# EAGLE design HPF_1_0 (EAGLE 8.3.2)
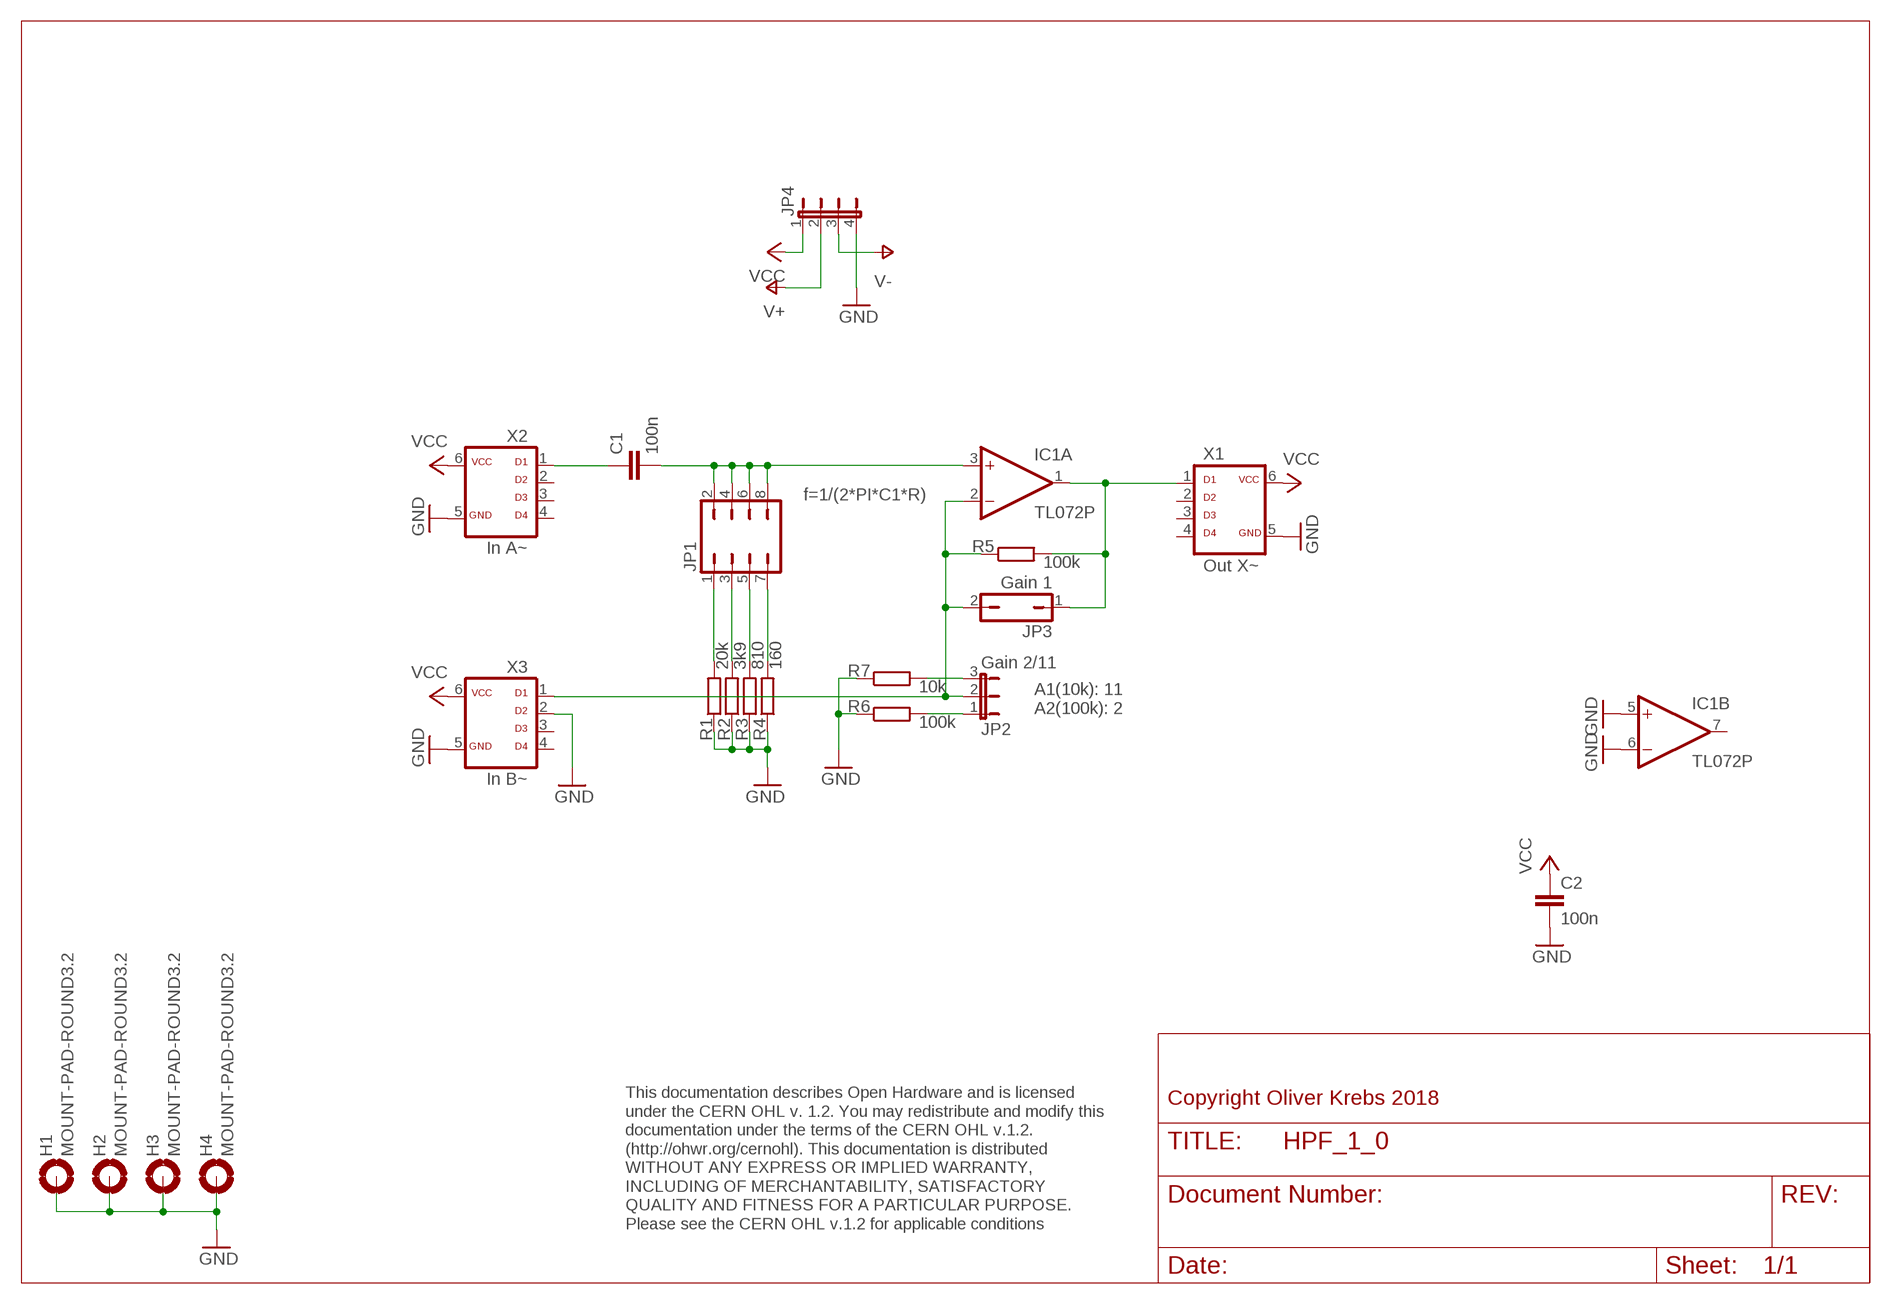
[diagram p0: schematic, sheet 1]

## Parts
C1  100n  C-EU050-025X075  [C050-025X075]
C2  100n  C-EU050-025X075  [C050-025X075]
H1  MOUNT-PAD-ROUND3.2  [3,2-PAD]
H2  MOUNT-PAD-ROUND3.2  [3,2-PAD]
H3  MOUNT-PAD-ROUND3.2  [3,2-PAD]
H4  MOUNT-PAD-ROUND3.2  [3,2-PAD]
IC1  TL072P  [DIL08]
JP1  JP4Q  [JP4Q]
JP2  Gain 2/11  JP2EJP2-U  [JP2-U]
JP3  Gain 1  JP1Q  [JP1]
JP4  JP4E  [JP4]
R1  20k  R-EU_0207/10  [0207/10]
R2  3k9  R-EU_0207/10  [0207/10]
R3  810  R-EU_0207/10  [0207/10]
R4  160  R-EU_0207/10  [0207/10]
R5  100k  R-EU_0207/10  [0207/10]
R6  100k  R-EU_0207/10  [0207/10]
R7  10k  R-EU_0207/10  [0207/10]
X1  Out X~  ML6D  [ML-6]
X2  In A~  ML6D  [ML-6]
X3  In B~  ML6D  [ML-6]

## Nets
GND: C2.2 H1.B3,2(MOUNT) H2.B3,2(MOUNT) H3.B3,2(MOUNT) H4.B3,2(MOUNT) IC1.5(B:+IN) IC1.6(B:-IN) JP4.4 R1.1 R2.1 R3.1 R4.1 R6.1 R7.1 X1.5 X2.5 X3.2 X3.5
N$1: JP1.1 R1.2
N$2: JP1.3 R2.2
N$3: JP1.5 R3.2
N$4: JP1.7 R4.2
N$5: IC1.2(A:-IN) JP2.2 JP3.2 R5.1 X3.1
N$6: C1.2 IC1.3(A:+IN) JP1.2 JP1.4 JP1.6 JP1.8
N$7: C1.1 X2.1
N$9: IC1.1(A:OUT) JP3.1 R5.2 X1.1
N$10: JP2.3 R7.2
N$11: JP2.1 R6.2
V+: JP4.2
V-: JP4.3
VCC: C2.1 JP4.1 X1.6 X2.6 X3.6
Unconnected: IC1.7(B:OUT) X1.2 X1.3 X1.4 X2.2 X2.3 X2.4 X3.3 X3.4

## Notes on the sheet
- f=1/(2*PI*C1*R)
- A1(10k): 11
  A2(100k): 2
- Copyright Oliver Krebs 2018
- This documentation describes Open Hardware and is licensed 
  under the CERN OHL v. 1.2. You may redistribute and modify this 
  documentation under the terms of the CERN OHL v.1.2. 
  (http://ohwr.org/cernohl). This documentation is distributed
  WITHOUT ANY EXPRESS OR IMPLIED WARRANTY, 
  INCLUDING OF MERCHANTABILITY, SATISFACTORY 
  QUALITY AND FITNESS FOR A PARTICULAR PURPOSE. 
  Please see the CERN OHL v.1.2 for applicable conditions

## Power pins joined to a net without a drawn wire
V+: IC1.8(P:V+)
V-: IC1.4(P:V-)

## Library data of the parts
C1 C2 = 01-my_rcl:C-EU: CAPACITOR, European symbol
H1-H4 = holes:MOUNT-PAD-ROUND: MOUNTING PAD, round
IC1 = 01-my-linear:TL072: OP AMP
JP1 = 01-my-jumper:JP4Q: JUMPER
JP2 = 01-my-jumper:JP2E: JUMPER
JP3 = 01-my-jumper:JP1Q: JUMPER
JP4 = 01-my-jumper:JP4E: JUMPER
R1-R7 = 01-my_rcl:R-EU_: RESISTOR, European symbol
X1-X3 = 01-my-con:ML6D

## Board
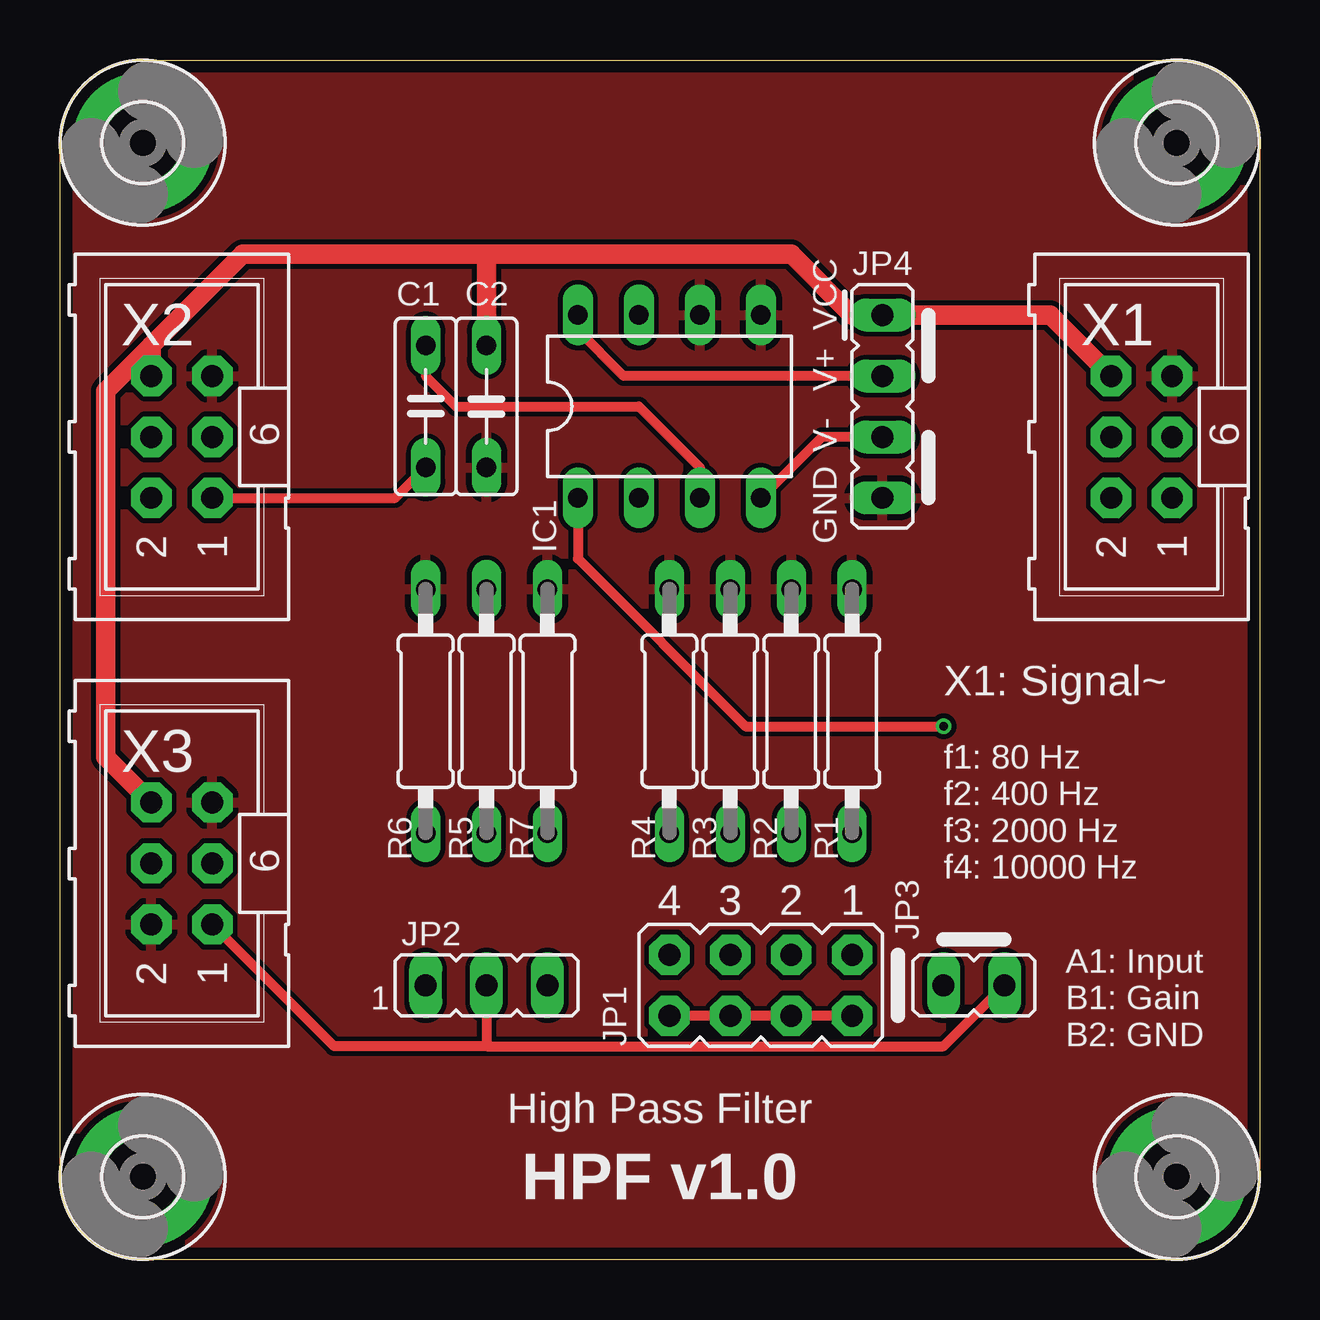
[diagram p1: board, top side]
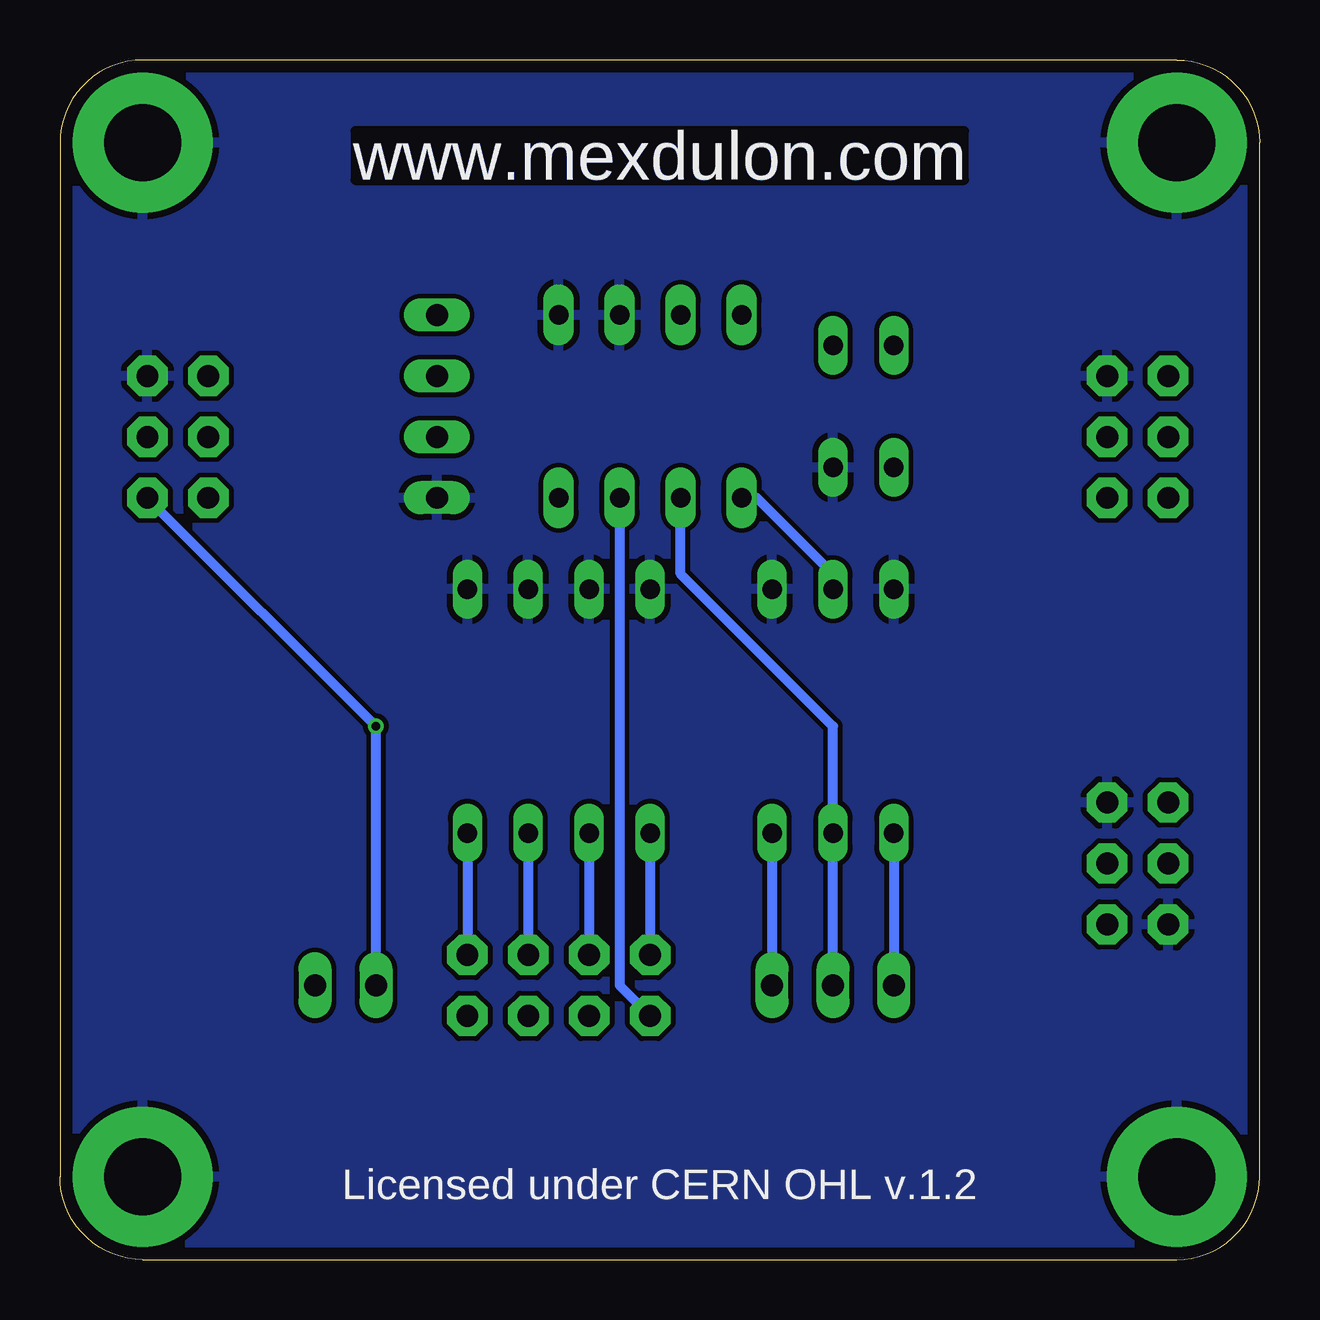
[diagram p2: board, bottom side, seen from below]

Size 50 x 50 mm. Coordinates in mm from the lower left corner, seen from the top.
Outline: 0,3.45 0,46.55 arc-90 3.45,50 46.55,50 arc-90 50,46.55 50,3.45 arc-90 46.55,0 3.45,0 arc-90 0,3.45
Copper layers (1*16): Top 0.035mm / dielectric 1.6mm / Bottom 0.035mm
Design rules "Elecrow_2-layer_PCB_eagle_rule_8mil": minimum track width 8mil, minimum drill 12mil, track to track 8mil, track to pad 8mil, pad to pad 8mil, via to via 8mil, smd to smd 0mil, copper to edge 20mil, drill to drill 10mil, minimum pad ring 6mil, minimum via ring 6mil, stop-mask expansion 0mil, vias tented up to drill 100mil, thermal gap 10mil

### Footprints (pad centres in the part's own frame; a part is rotated, then mirrored left to right if it is on the bottom)
C050-025X075 = drill 0.813 long: 1 -2.54,0; 2 2.54,0
3,2-PAD = drill 3.2 pad 5.842: B3,2 0,0
DIL08 = drill 0.813 pad 1.27 long: 1 -3.81,-3.81; 2 -1.27,-3.81; 3 1.27,-3.81; 4 3.81,-3.81; 5 3.81,3.81; 6 1.27,3.81; 7 -1.27,3.81; 8 -3.81,3.81
JP4Q = drill 0.914 pad 1.676 octagon: 1 -3.81,-1.27; 2 -3.81,1.27; 3 -1.27,-1.27; 4 -1.27,1.27; 5 1.27,-1.27; 6 1.27,1.27; 7 3.81,-1.27; 8 3.81,1.27
JP2-U = drill 0.914 long: 1 -2.54,0; 2 0,0; 3 2.54,0
JP1 = drill 0.914 long: 1 0,-1.27; 2 0,1.27
JP4 = drill 0.914 long: 1 -3.81,0; 2 -1.27,0; 3 1.27,0; 4 3.81,0
0207/10 = drill 0.813 long: 1 -5.08,0; 2 5.08,0
ML-6 = drill 0.914 pad 1.676 octagon: 1 -2.54,-1.27; 2 -2.54,1.27; 3 0,-1.27; 4 0,1.27; 5 2.54,-1.27; 6 2.54,1.27

### Placement (x,y rotation side)
C1  15.24,35.56 90 top
C2  17.78,35.56 270 top
H1  3.45,3.45 0 top
H2  3.45,46.55 0 top
H3  46.55,46.55 0 top
H4  46.55,3.45 0 top
IC1  25.4,35.56 0 top
JP1  29.21,11.43 180 top
JP2  17.78,11.43 0 top
JP3  38.1,11.43 270 top
JP4  34.29,35.56 270 top
R1  33.02,22.86 270 top
R2  30.48,22.86 270 top
R3  27.94,22.86 270 top
R4  25.4,22.86 270 top
R5  17.78,22.86 90 top
R6  15.24,22.86 270 top
R7  20.32,22.86 270 top
X1  45.09,34.29 90 top
X2  5.08,34.29 90 top
X3  5.08,16.51 90 top

### Tracks (layer width: path | path; a pad name or v marks a point on that pad's centre or on a via)
GND
  pour Bottom (isolate 0.203): 0,50.16 50.8,50.16 50.8,0 0,0
  pour Top (isolate 0.203): 0,50.16 50.8,50.16 50.8,0 0,0
N$1
  Bottom 0.406: R1.2 JP1.1
N$2
  Bottom 0.406: R2.2 JP1.3
N$3
  Bottom 0.406: R3.2 JP1.5
N$4
  Bottom 0.406: R4.2 JP1.7
N$5
  Top 0.406: 17.78,8.89 11.43,8.89 X3.1 | 17.78,8.89 36.83,8.89 JP3.2 | JP2.2 17.78,8.89
  Bottom 0.406: JP2.2 R5.1 17.78,22.23 24.13,28.57 IC1.2
N$6
  Top 0.406: C1.2 15.24,36.83 16.51,35.56 24.13,35.56 26.67,33.02 IC1.3 | JP1.2 JP1.4 JP1.6 JP1.8
  Bottom 0.406: IC1.3 26.67,11.43 JP1.8
N$7
  Top 0.406: X2.1 13.97,31.75 C1.1
N$9  (via drill 0.35)
  Top 0.406: IC1.1 21.59,29.21 28.57,22.23 v36.83,22.23
  Bottom 0.406: JP3.1 v36.83,22.23 X1.1 | R5.2 17.78,28.57 20.95,31.75 IC1.1
N$10
  Bottom 0.406: R7.2 JP2.3
N$11
  Bottom 0.406: R6.2 JP2.1
V+
  Top 0.406: JP4.2 23.5,36.83 21.59,38.73 IC1.8
V-
  Top 0.406: JP4.3 31.75,34.29 IC1.4
VCC
  Top 0.813: X1.6 41.27,39.37 JP4.1 33.02,39.37 30.48,41.91 17.78,41.91 | C2.1 17.78,41.91 | 17.78,41.91 7.62,41.91 3.81,38.1 | 3.81,38.1 X2.6 | 3.81,38.1 1.91,36.2 1.91,20.95 X3.6

### Text on the board
Bottom: www.mexdulon.com
tNames: VCC | V+ | V- | GND | X1: Signal~ | f1: 80 Hz / f2: 400 Hz / f3: 2000 Hz / f4: 10000 Hz | A1: Input / B1: Gain / B2: GND | High Pass Filter | HPF v1.0
bNames: www.mexdulon.com | Licensed under CERN OHL v.1.2
200bmp: E:/Bilder/Elektronik/Modulion/Mexdulon/mexdulon_50x50_pcb.bmp